# Altium schematic sheet rotor.SchDoc
size A3; SheetNumber: 1; SheetTotal: 1
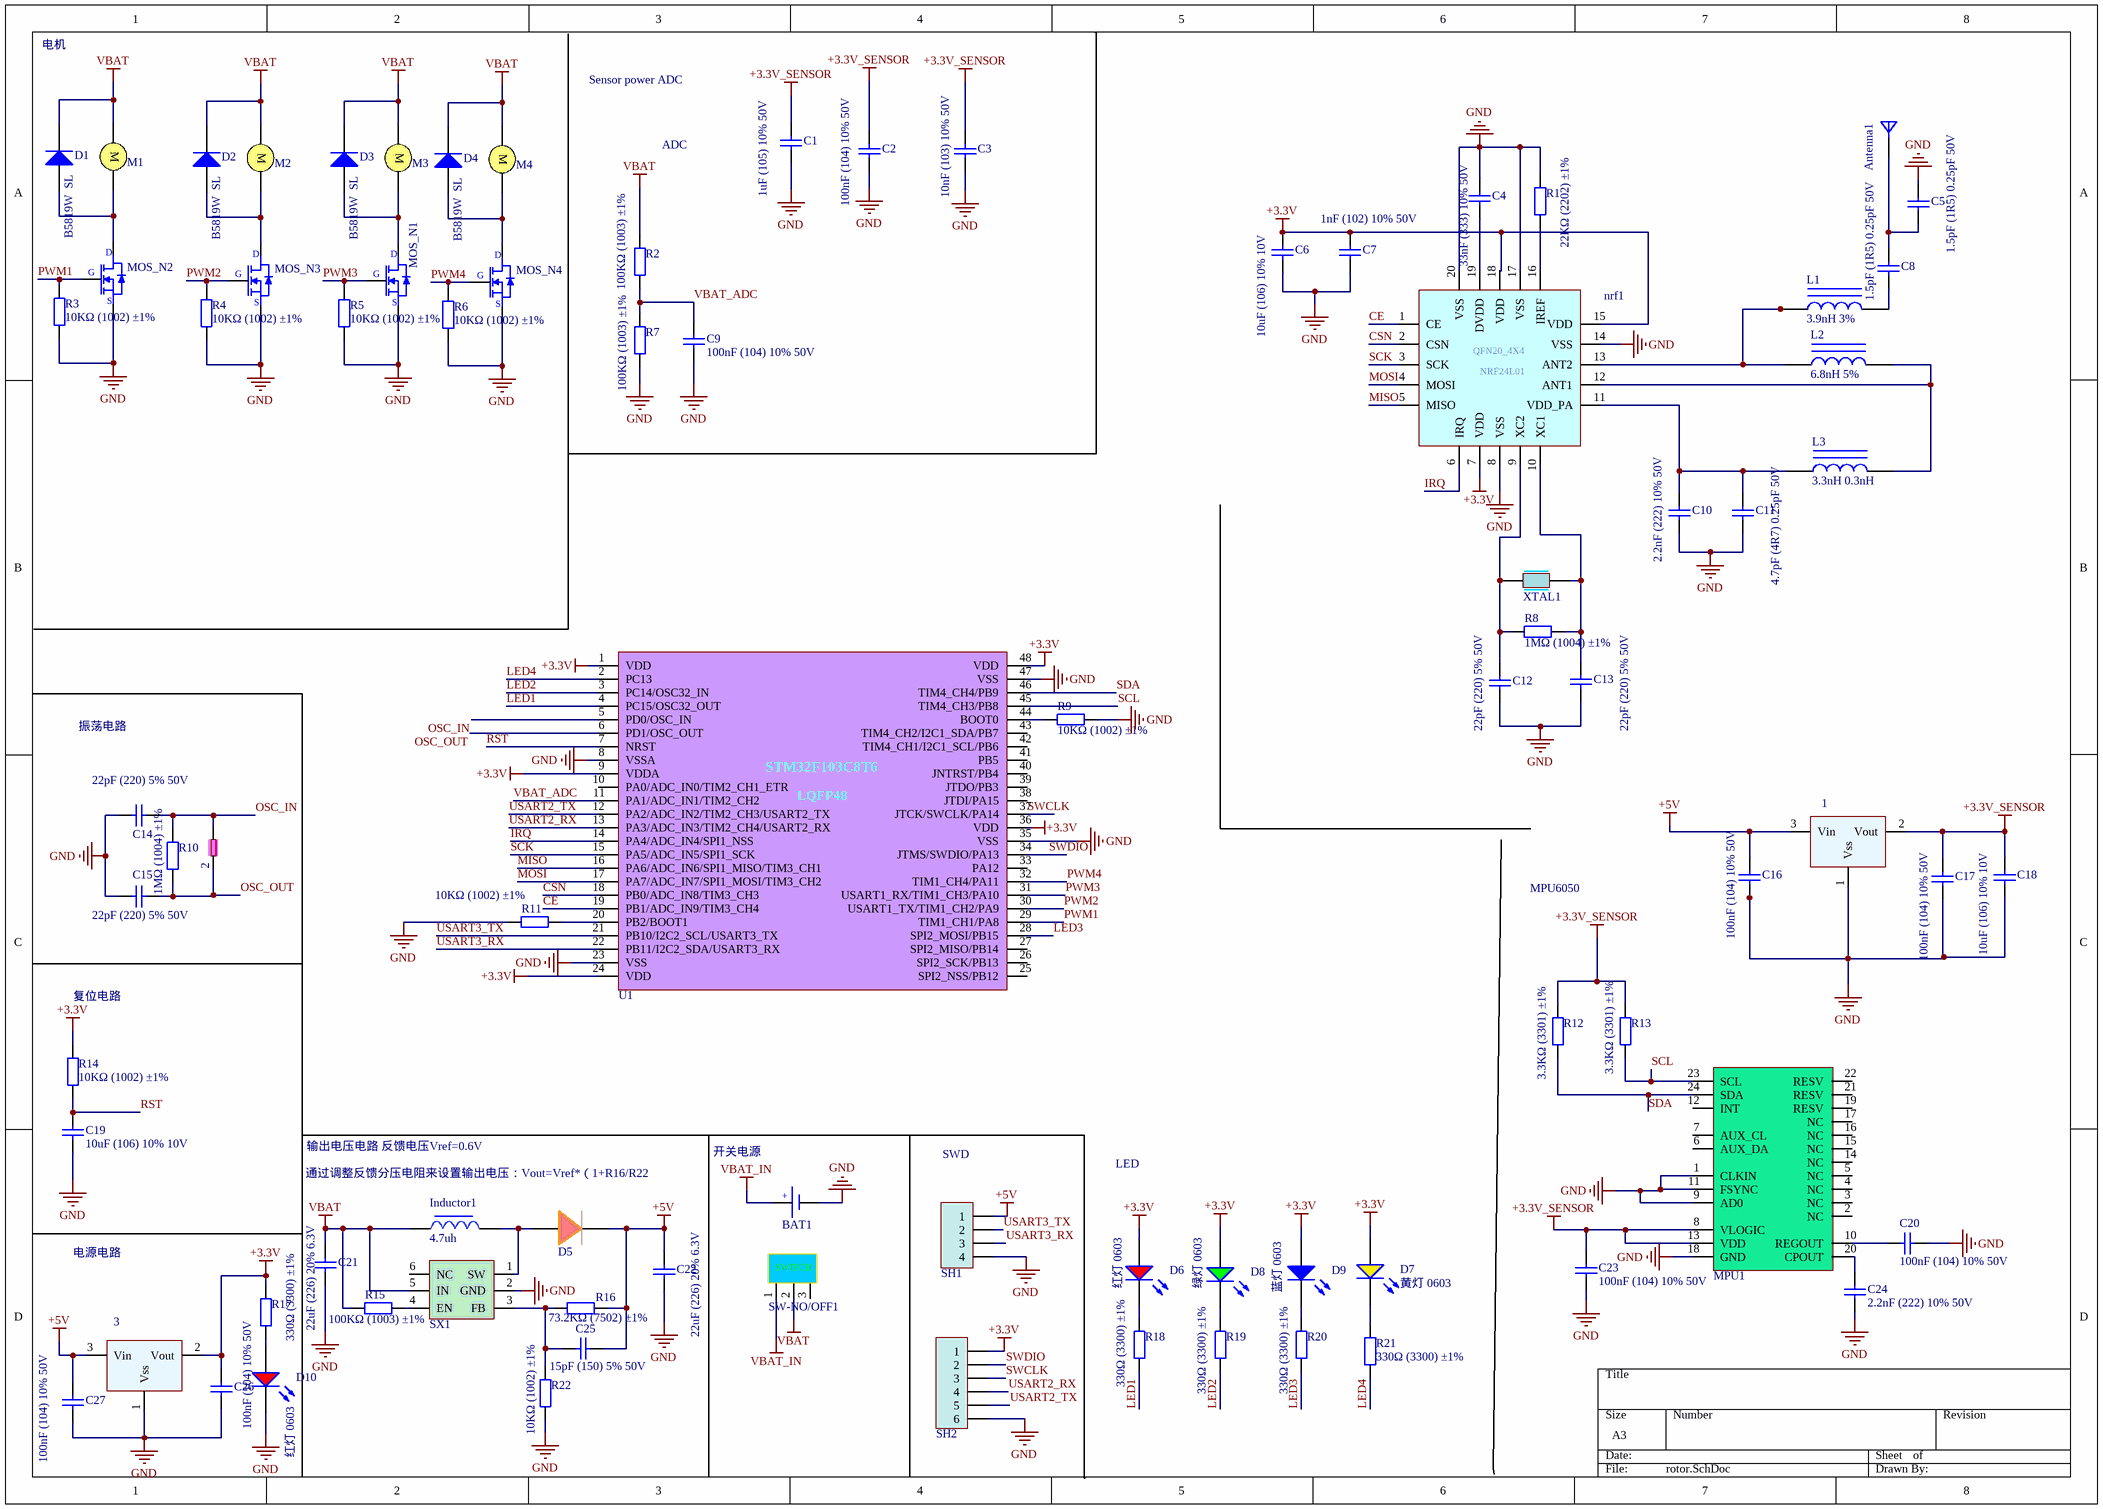
[diagram p0: rotor.SchDoc]

## Parts
1  662K-3.3V(SOT-23-3)  [SOT-23-3]  (value not drawn)
2  5032-8MHZ  [5032-8MHZ]  (value not drawn)
3  662K-3.3V(SOT-23-3)  [SOT-23-3]  (value not drawn)
Antenna1  Antenna  [Antenna]  (value not drawn)
BAT1  BAT  [BAT]  (value not drawn)
C1  1uF (105) 10% 50V  [0603_C]
C2  100nF (104) 10% 50V  [0603_C]
C3  10nF (103) 10% 50V  [0603_C]
C4  33nF (333) 10% 50V  [0603_C]
C5  1.5pF (1R5) 0.25pF 50V  [0402_C]
C6  10uF (106) 10% 10V  [0603_C]
C7  1nF (102) 10% 50V  [0603_C]
C8  1.5pF (1R5) 0.25pF 50V  [0402_C]
C9  100nF (104) 10% 50V  [0603_C]
C10  2.2nF (222) 10% 50V  [0603_C]
C11  4.7pF (4R7) 0.25pF 50V  [0603_C]
C12  22pF (220) 5% 50V  [0603_C]
C13  22pF (220) 5% 50V  [0603_C]
C14  22pF (220) 5% 50V  [0603_C]
C15  22pF (220) 5% 50V  [0603_C]
C16  100nF (104) 10% 50V  [0603_C]
C17  100nF (104) 10% 50V  [0603_C]
C18  10uF (106) 10% 10V  [0603_C]
C19  10uF (106) 10% 10V  [0603_C]
C20  100nF (104) 10% 50V  [0603_C]
C21  22uF (226) 20% 6.3V  [0603_C]
C22  22uF (226) 20% 6.3V  [0603_C]
C23  100nF (104) 10% 50V  [0603_C]
C24  2.2nF (222) 10% 50V  [0603_C]
C25  15pF (150) 5% 50V  [0603_C]
C26  100nF (104) 10% 50V  [0603_C]
C27  100nF (104) 10% 50V  [0603_C]
D1  B5819W  SL  [SOD-123]
D2  B5819W  SL  [SOD-123]
D3  B5819W  SL  [SOD-123]
D4  B5819W  SL  [SOD-123]
D5  SMA/DO-214  [SMA/DO-214]  (value not drawn)
D6  红灯 0603  [0603_LED_S1]
D7  黄灯 0603  [0603_LED_S1]
D8  绿灯 0603  [0603_LED_S1]
D9  蓝灯 0603  [0603_LED_S1]
D10  红灯 0603  [0603_LED_S1]
Inductor1  Inductor  [CD32]  (value not drawn)
L1  3.9nH 3%  [0402_L]
L2  6.8nH 5%  [0402_L]
L3  3.3nH 0.3nH  [0402_L]
M1  MOTO  [MOTO]  (value not drawn)
M2  MOTO  [MOTO]  (value not drawn)
M3  MOTO  [MOTO]  (value not drawn)
M4  MOTO  [MOTO]  (value not drawn)
MOS_N1  MOS_N  [SOT-23-3]  (value not drawn)
MOS_N2  MOS_N  [SOT-23-3]  (value not drawn)
MOS_N3  MOS_N  [SOT-23-3]  (value not drawn)
MOS_N4  MOS_N  [SOT-23-3]  (value not drawn)
MPU1  MPU6050  [QFN24_4X4]  (value not drawn)
nrf1  nrf24l01  [QFN20_4X4]  (value not drawn)
R1  22KΩ (2202) ±1%  [0603_R]
R2  100KΩ (1003) ±1%  [0603_R]
R3  10KΩ (1002) ±1%  [0603_R]
R4  10KΩ (1002) ±1%  [0603_R]
R5  10KΩ (1002) ±1%  [0603_R]
R6  10KΩ (1002) ±1%  [0603_R]
R7  100KΩ (1003) ±1%  [0603_R]
R8  1MΩ (1004) ±1%  [0603_R]
R9  10KΩ (1002) ±1%  [0603_R]
R10  1MΩ (1004) ±1%  [0603_R]
R11  10KΩ (1002) ±1%  [0603_R]
R12  3.3KΩ (3301) ±1%  [0603_R]
R13  3.3KΩ (3301) ±1%  [0603_R]
R14  10KΩ (1002) ±1%  [0603_R]
R15  100KΩ (1003) ±1%  [0603_R]
R16  73.2KΩ (7502) ±1%  [0603_R]
R17  330Ω (3300) ±1%  [0603_R]
R18  330Ω (3300) ±1%  [0603_R]
R19  330Ω (3300) ±1%  [0603_R]
R20  330Ω (3300) ±1%  [0603_R]
R21  330Ω (3300) ±1%  [0603_R]
R22  10KΩ (1002) ±1%  [0603_R]
SH1  SH1.0mm-4PIN  [SH1.0mm-4PIN]  (value not drawn)
SH2  SH1.0mm-6PIN  [SH1.0mm-6PIN]  (value not drawn)
SW-NO/OFF1  SW-NO/OFF  [SW-NO/OFF-PIN3]  (value not drawn)
SX1  SX1308  [SX1308]  (value not drawn)
U1  STM32F103C8T6  [STM32F103C8T6]  (value not drawn)
XTAL1  Crystal Oscillator 3225  [Crystal Oscillator 3225]  (value not drawn)

## Nets
+3.3V: 3.2(Vout) C6.2 C7.2 C26.2 D6.A D7.A D8.A D9.A nrf1.7(VDD) nrf1.15(VDD) R14.2 R17.2 SH2.1 U1.1(VDD) U1.9(VDDA) U1.24(VDD) U1.36(VDD) U1.48(VDD)
+3.3V_SENSOR: 1.2(Vout) C1.2 C2.2 C3.2 C17.2 C18.2 C23.2 MPU1.8(VLOGIC) MPU1.13(VDD) R12.2 R13.2
+5V: 1.3(Vin) 3.3(Vin) C16.2 C22.2 C25.2 C27.2 D5.2 R16.2 SH1.1
GND: 1.1(Vss) 3.1(Vss) BAT1.2(-) C1.1 C2.1 C3.1 C4.2 C5.2 C6.1 C7.1 C9.1 C10.1 C11.1 C12.1 C13.1 C14.1 C15.1 C16.1 C17.1 C18.1 C19.1 C20.2 C21.1 C22.1 C23.1 C24.1 C26.1 C27.1 D10.K MOS_N1.2(S) MOS_N2.2(S) MOS_N3.2(S) MOS_N4.2(S) MPU1.1(CLKIN) MPU1.9(AD0) MPU1.11(FSYNC) MPU1.18(GND) nrf1.8(VSS) nrf1.14(VSS) nrf1.17(VSS) nrf1.20(VSS) R1.2 R3.1 R4.1 R5.1 R6.1 R7.1 R9.2 R11.2 R22.1 SH1.4 SH2.6 SX1.2(GND) U1.8(VSSA) U1.23(VSS) U1.35(VSS) U1.47(VSS)
VBAT: C21.2 D1.2(K) D2.2(K) D3.2(K) D4.2(K) Inductor1.1 M1.1 M2.1 M3.1 M4.1 R2.2 R15.1 SW-NO/OFF1.2 SX1.5(IN)
VBAT_IN: BAT1.1(+) SW-NO/OFF1.1
CE: nrf1.1(CE) U1.19(PB1/ADC_IN9/TIM3_CH4)
CSN: nrf1.2(CSN) U1.18(PB0/ADC_IN8/TIM3_CH3)
IRQ: nrf1.6(IRQ) U1.14(PA4/ADC_IN4/SPI1_NSS)
LED1: R18.1 U1.4(PC15/OSC32_OUT)
LED2: R19.1 U1.3(PC14/OSC32_IN)
LED3: R20.1 U1.28(SPI2_MOSI/PB15)
LED4: R21.1 U1.2(PC13)
MISO: nrf1.5(MISO) U1.16(PA6/ADC_IN6/SPI1_MISO/TIM3_CH1)
MOSI: nrf1.4(MOSI) U1.17(PA7/ADC_IN7/SPI1_MOSI/TIM3_CH2)
OSC_IN: 2.3 C14.2 R10.2 U1.5(PD0/OSC_IN)
OSC_OUT: 2.1 C15.2 R10.1 U1.6(PD1/OSC_OUT)
PWM1: MOS_N2.1(G) R3.2 U1.29(TIM1_CH1/PA8)
PWM2: MOS_N3.1(G) R4.2 U1.30(USART1_TX/TIM1_CH2/PA9)
PWM3: MOS_N1.1(G) R5.2 U1.31(USART1_RX/TIM1_CH3/PA10)
PWM4: MOS_N4.1(G) R6.2 U1.32(TIM1_CH4/PA11)
RST: C19.2 R14.1 U1.7(NRST)
SCK: nrf1.3(SCK) U1.15(PA5/ADC_IN5/SPI1_SCK)
SCL: MPU1.23(SCL) R13.1 U1.45(TIM4_CH3/PB8)
SDA: MPU1.24(SDA) R12.1 U1.46(TIM4_CH4/PB9)
SWCLK: SH2.3 U1.37(JTCK/SWCLK/PA14)
SWDIO: SH2.2 U1.34(JTMS/SWDIO/PA13)
USART2_RX: SH2.4 U1.13(PA3/ADC_IN3/TIM2_CH4/USART2_RX)
USART2_TX: SH2.5 U1.12(PA2/ADC_IN2/TIM2_CH3/USART2_TX)
USART3_RX: SH1.3 U1.22(PB11/I2C2_SDA/USART3_RX)
USART3_TX: SH1.2 U1.21(PB10/I2C2_SCL/USART3_TX)
VBAT_ADC: C9.2 R2.1 R7.2 U1.11(PA1/ADC_IN1/TIM2_CH2)
NetAntenna1_1: Antenna1.1 C5.1 C8.2
NetC4_1: C4.1 nrf1.19(DVDD)
NetC8_1: C8.1 L1.2
NetC10_2: C10.2 C11.2 L3.1 nrf1.11(VDD_PA)
NetC12_2: C12.2 nrf1.9(XC2) R8.1 XTAL1.3
NetC13_2: C13.2 nrf1.10(XC1) R8.2 XTAL1.1
NetC20_1: C20.1 MPU1.10(REGOUT)
NetC24_2: C24.2 MPU1.20(CPOUT)
NetC25_1: C25.1 R16.1 R22.2 SX1.3(FB)
NetD1_1: D1.1(A) M1.2 MOS_N2.3(D)
NetD2_1: D2.1(A) M2.2 MOS_N3.3(D)
NetD3_1: D3.1(A) M3.2 MOS_N1.3(D)
NetD4_1: D4.1(A) M4.2 MOS_N4.3(D)
NetD5_1: D5.1 Inductor1.2 SX1.1(SW)
NetD6_K: D6.K R18.2
NetD7_K: D7.K R21.2
NetD8_K: D8.K R19.2
NetD9_K: D9.K R20.2
NetD10_A: D10.A R17.1
NetL1_1: L1.1 L2.1 nrf1.13(ANT2)
NetL2_2: L2.2 L3.2 nrf1.12(ANT1)
Netnrf1_16: nrf1.16(IREF) R1.1
NetR9_1: R9.1 U1.44(BOOT0)
NetR11_1: R11.1 U1.20(PB2/BOOT1)
NetR15_2: R15.2 SX1.4(EN)

Not connected (* = marked no-connect by the designer): MPU1 2(NC) 3(NC) 4(NC) 5(NC) 6(AUX_DA) 7(AUX_CL) 12(INT) 14(NC) 15(NC) 16(NC) 17(NC) 19(RESV) 21(RESV) 22(RESV); nrf1 18(VDD); SW-NO/OFF1 3; SX1 6(NC); U1 10(PA0/ADC_IN0/TIM2_CH1_ETR) 25(SPI2_NSS/PB12) 26(SPI2_SCK/PB13) 27(SPI2_MISO/PB14) 33(PA12) 38(JTDI/PA15) 39(JTDO/PB3) 40(JNTRST/PB4) 41(PB5) 42(TIM4_CH1/I2C1_SCL/PB6) 43(TIM4_CH2/I2C1_SDA/PB7)

## Notes on the sheet
- 电机
- Sensor power ADC
- ADC
- 振荡电路
- MPU6050
- 复位电路
- 通过调整反馈分压电阻来设置输出电压：Vout=Vref*（1+R16/R22
- 输出电压电路 反馈电压Vref=0.6V
- 开关电源
- SWD
- LED
- 电源电路
- (in symbol Inductor) 4.7uh
- (in symbol MOTO) M
- (in symbol QFN20-4X4) QFN20_4X4; NRF24L01
- (in symbol STM32F103C8T6) LQFP48
- (in symbol SW-NO/OFF-PIN3) SWITCH

## Library data of the parts
C1 = 0603 1uF (105) 10% 50V: 贴片电容; ComponentLink1Description: 供应商链接; ComponentLink1URL: http://www.szlcsc.com/product/details_16531.html; Package: 0603; Supplier: LC; SuppliersPartNumber: C15849
C2 C9 C16 C17 C20 C23 C26 C27 = 0603 100nF (104) 10% 50V: 贴片电容; ComponentLink1Description: 供应商链接; ComponentLink1URL: http://www.szlcsc.com/product/details_15331.html; Package: 0603; Supplier: LC; SuppliersPartNumber: C14663
C3 = 0603 10nF (103) 10% 50V: 贴片电容; ComponentLink1Description: 供应商链接; ComponentLink1URL: http://www.szlcsc.com/product/details_58143.html; Package: 0603; Supplier: LC; SuppliersPartNumber: C57112
C4 = 0603 33nF (333) 10% 50V: 贴片电容; ComponentLink1Description: 供应商链接; ComponentLink1URL: http://www.szlcsc.com/product/details_21829.html; Package: 0603; Supplier: LC; SuppliersPartNumber: C21117
C5 C8 = 0402 1.5pF (1R5) 0.25pF 50V: 贴片电容; ComponentLink1Description: 供应商链接; ComponentLink1URL: http://www.szlcsc.com/product/details_1904.html; Package: 0402; Supplier: LC; SuppliersPartNumber: C1552
C6 C18 C19 = 0603 10uF (106) 10% 10V: 贴片电容; ComponentLink1Description: 供应商链接; ComponentLink1URL: http://www.szlcsc.com/product/details_20411.html; Package: 0603; Supplier: LC; SuppliersPartNumber: C19702
C7 = 0603 1nF (102) 10% 50V: 贴片电容; ComponentLink1Description: 供应商链接; ComponentLink1URL: http://www.szlcsc.com/product/details_1940.html; Package: 0603; Supplier: LC; SuppliersPartNumber: C1588
C10 C24 = 0603 2.2nF (222) 10% 50V: 贴片电容; ComponentLink1Description: 供应商链接; ComponentLink1URL: http://www.szlcsc.com/product/details_1956.html; Package: 0603; Supplier: LC; SuppliersPartNumber: C1604
C11 = 0603 4.7pF (4R7) 0.25pF 50V: 贴片电容; ComponentLink1Description: 供应商链接; ComponentLink1URL: http://www.szlcsc.com/product/details_2021.html; Package: 0603; Supplier: LC; SuppliersPartNumber: C1669
C12-C15 = 0603 22pF (220) 5% 50V: 贴片电容; ComponentLink1Description: 供应商链接; ComponentLink1URL: http://www.szlcsc.com/product/details_2005.html; Package: 0603; Supplier: LC; SuppliersPartNumber: C1653
C21 C22 = 0603 22uF (226) 20% 6.3V: 贴片电容; ComponentLink1Description: 供应商链接; ComponentLink1URL: http://www.szlcsc.com/product/details_60514.html; Package: 0603; Supplier: LC; SuppliersPartNumber: C59461
C25 = 0603 15pF (150) 5% 50V: 贴片电容; ComponentLink1Description: 供应商链接; ComponentLink1URL: http://www.szlcsc.com/product/details_1996.html; Package: 0603; Supplier: LC; SuppliersPartNumber: C1644
D1-D4 = SOD-123 B5819W  SL: 肖特基二极管; ComponentLink1Description: 供应商链接; ComponentLink1URL: http://www.szlcsc.com/product/details_9093.html; Package: SOD-123; Supplier: LC; SuppliersPartNumber: C8598
D6 D10 = 0603 红灯: 发光二极管; ComponentLink1Description: 供应商链接; ComponentLink1URL: http://www.szlcsc.com/product/details_2659.html; Package: 0603; Supplier: LC; SuppliersPartNumber: C2286
D7 = 0603 黄灯: 发光二极管; ComponentLink1Description: 供应商链接; ComponentLink1URL: http://www.szlcsc.com/product/details_73147.html; Package: 0603; Supplier: LC; SuppliersPartNumber: C72038
D8 = 0603 绿灯: 发光二极管; ComponentLink1Description: 供应商链接; ComponentLink1URL: http://www.szlcsc.com/product/details_73152.html; Package: 0603; Supplier: LC; SuppliersPartNumber: C72043
D9 = 0603 蓝灯: 发光二极管; ComponentLink1Description: 供应商链接; ComponentLink1URL: http://www.szlcsc.com/product/details_73150.html; Package: 0603; Supplier: LC; SuppliersPartNumber: C72041
L1 = 0402 3.9nH 3%: 贴片电感; ComponentLink1Description: 供应商链接; ComponentLink1URL: http://www.szlcsc.com/product/details_14690.html; Package: 0402; Supplier: LC; SuppliersPartNumber: C14033
L2 = 0402 6.8nH 5%: 贴片电感; ComponentLink1Description: 供应商链接; ComponentLink1URL: http://www.szlcsc.com/product/details_33003.html; Package: 0402; Supplier: LC; SuppliersPartNumber: C32041
L3 = 0402 3.3nH 0.3nH: 贴片电感; ComponentLink1Description: 供应商链接; ComponentLink1URL: http://www.szlcsc.com/product/details_27873.html; Package: 0402; Supplier: LC; SuppliersPartNumber: C27124
MOS_N1-MOS_N4 = MOS_N_(SOT-23-3)
MPU1 = MPU6050(QFN24_4X4)
nrf1 = QFN20-4X4
R1 = 0603 22KΩ (2202) 1%: 贴片电阻; ComponentLink1Description: 供应商链接; ComponentLink1URL: http://www.szlcsc.com/product/details_32812.html; Package: 0603; Supplier: LC; SuppliersPartNumber: C31850
R2 R7 R15 = 0603 100KΩ (1003) 1%: 贴片电阻; ComponentLink1Description: 供应商链接; ComponentLink1URL: http://www.szlcsc.com/product/details_26546.html; Package: 0603; Supplier: LC; SuppliersPartNumber: C25803
R3-R6 R9 R11 R14 R22 = 0603 10KΩ (1002) 1%: 贴片电阻; ComponentLink1Description: 供应商链接; ComponentLink1URL: http://www.szlcsc.com/product/details_26547.html; Package: 0603; Supplier: LC; SuppliersPartNumber: C25804
R8 R10 = 0603 1MΩ (1004) 1%: 贴片电阻; ComponentLink1Description: 供应商链接; ComponentLink1URL: http://www.szlcsc.com/product/details_23662.html; Package: 0603; Supplier: LC; SuppliersPartNumber: C22935
R12 R13 = 0603 3.3KΩ (3301) 1%: 贴片电阻; ComponentLink1Description: 供应商链接; ComponentLink1URL: http://www.szlcsc.com/product/details_23705.html; Package: 0603; Supplier: LC; SuppliersPartNumber: C22978
R16 = 0603 75KΩ (7502) 1%: 贴片电阻; ComponentLink1Description: 供应商链接; ComponentLink1URL: http://www.szlcsc.com/product/details_23969.html; Package: 0603; Supplier: LC; SuppliersPartNumber: C23242
R17-R21 = 0603 330Ω (3300) 1%: 贴片电阻; ComponentLink1Description: 供应商链接; ComponentLink1URL: http://www.szlcsc.com/product/details_23865.html; Package: 0603; Supplier: LC; SuppliersPartNumber: C23138
SW-NO/OFF1 = SW-NO/OFF-PIN3